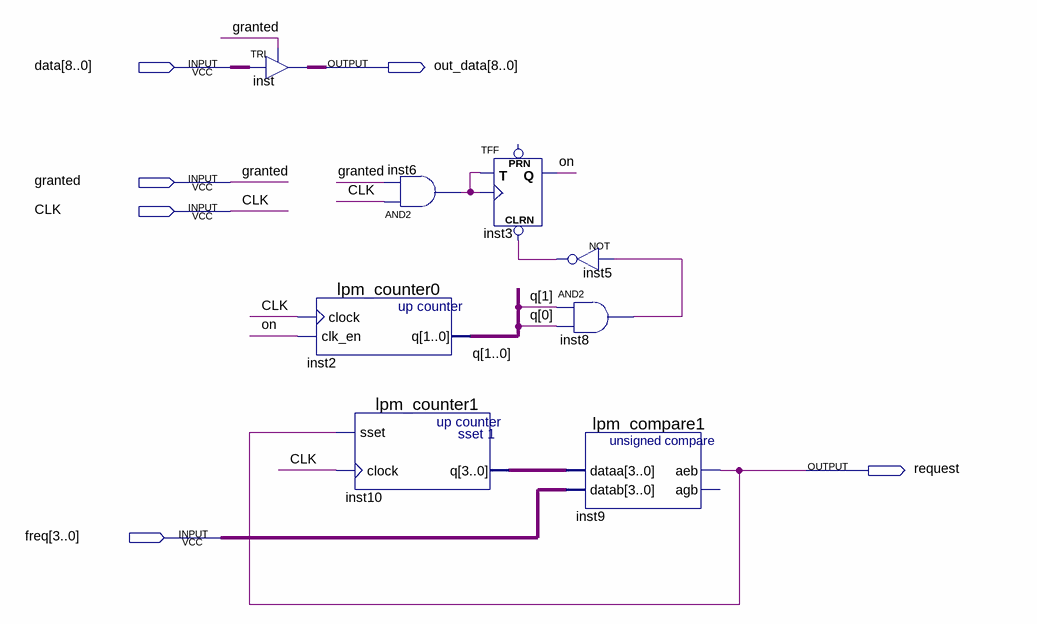
[diagram p0: schematic sheet]
// Quartus schematic master.bdf as structural Verilog: 8 symbols, 6 pins
module master (
  input  [8:0] data,
  input  granted,
  input  CLK,
  input  [3:0] freq,
  output [8:0] out_data,
  output request
);

  wire inst5_out, inst6_out, inst8_out, on;
  wire [1:0] q;
  wire [3:0] inst10_q;

  TRI inst[8:0] (.IN(data), .OE(granted), .OUT(out_data));
  lpm_counter0 inst2 (.clock(CLK), .clk_en(on), .q(q));
  and inst6 (inst6_out, CLK, granted);
  lpm_counter1 inst10 (.sset(request), .clock(CLK), .q(inst10_q));
  TFF inst3 (.CLRN(inst5_out), .T(inst6_out), .CLK(inst6_out), .Q(on));  // open: PRN
  not inst5 (inst5_out, inst8_out);
  and inst8 (inst8_out, q[1], q[0]);
  lpm_compare1 inst9 (.dataa(inst10_q), .datab(freq), .aeb(request));  // open: agb
endmodule
